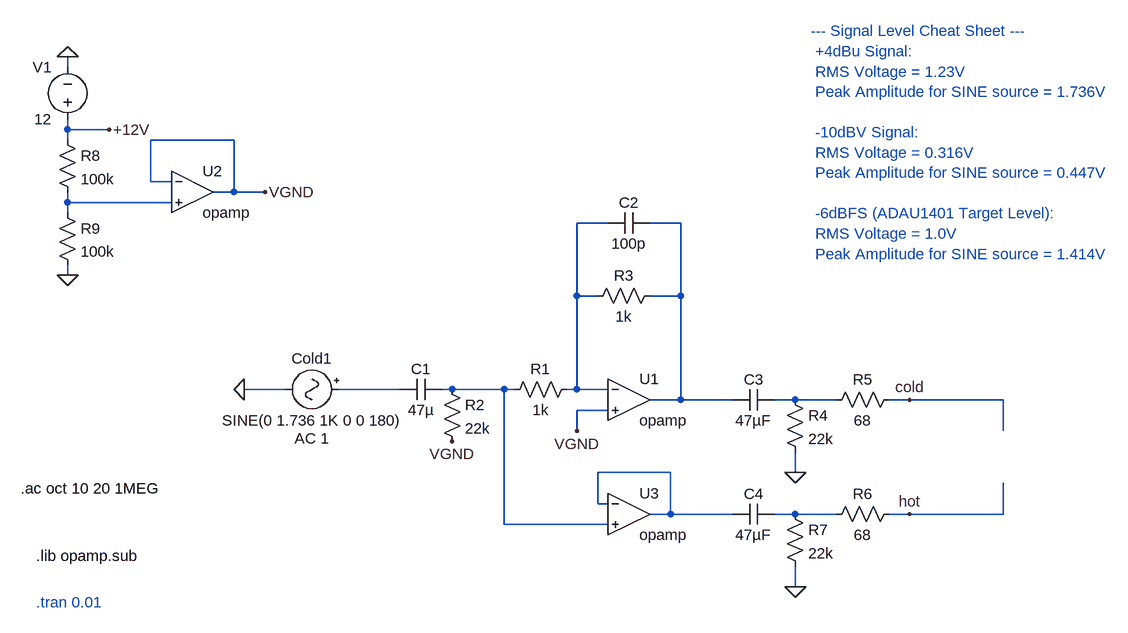
[diagram p0: schematic Output_Interface.asc]
Output_Interface.asc, the LTspice schematic file:
Version 4.1
SHEET 1 996 680
WIRE -640 -384 -640 -400
WIRE -640 -288 -640 -304
WIRE -576 -288 -640 -288
WIRE -640 -272 -640 -288
WIRE -384 -272 -512 -272
WIRE -512 -208 -512 -272
WIRE -480 -208 -512 -208
WIRE -384 -192 -384 -272
WIRE -384 -192 -416 -192
WIRE -336 -192 -384 -192
WIRE -640 -176 -640 -192
WIRE -480 -176 -640 -176
WIRE -640 -160 -640 -176
WIRE 192 -144 144 -144
WIRE 304 -144 256 -144
WIRE -640 -64 -640 -80
WIRE 144 -32 144 -144
WIRE 176 -32 144 -32
WIRE 304 -32 304 -144
WIRE 304 -32 256 -32
WIRE -304 112 -368 112
WIRE -128 112 -224 112
WIRE -48 112 -64 112
WIRE 32 112 -48 112
WIRE 48 112 32 112
WIRE 144 112 144 -32
WIRE 144 112 128 112
WIRE 192 112 144 112
WIRE 304 128 304 -32
WIRE 304 128 256 128
WIRE 384 128 304 128
WIRE 480 128 448 128
WIRE 544 128 480 128
WIRE 656 128 624 128
WIRE 800 128 656 128
WIRE 192 144 144 144
WIRE 144 176 144 144
WIRE 800 176 800 128
WIRE 288 240 176 240
WIRE 480 240 480 208
WIRE 176 288 176 240
WIRE 192 288 176 288
WIRE 288 304 288 240
WIRE 288 304 256 304
WIRE 384 304 288 304
WIRE 480 304 448 304
WIRE 544 304 480 304
WIRE 656 304 624 304
WIRE 800 304 800 256
WIRE 800 304 656 304
WIRE 32 320 32 112
WIRE 192 320 32 320
WIRE 480 416 480 384
FLAG -368 112 0
FLAG -48 192 VGND
FLAG 480 240 0
FLAG 144 176 VGND
FLAG 480 416 0
FLAG -640 -400 0
FLAG -640 -64 0
FLAG -336 -192 VGND
FLAG -576 -288 +12V
FLAG 656 304 hot
FLAG 656 128 cold
SYMBOL OpAmps\\opamp 224 64 R0
SYMATTR InstName U1
SYMBOL Misc\\signal -208 112 R90
WINDOW 0 -32 56 VBottom 2
WINDOW 3 32 56 VTop 2
WINDOW 123 60 56 VTop 2
WINDOW 39 0 0 Left 0
SYMATTR InstName Cold1
SYMATTR Value SINE(0 1.736 1K 0 0 180)
SYMATTR Value2 AC 1
SYMBOL res 144 96 R90
WINDOW 0 0 56 VBottom 2
WINDOW 3 32 56 VTop 2
SYMATTR InstName R1
SYMATTR Value 1k
SYMBOL cap -64 96 R90
WINDOW 0 0 32 VBottom 2
WINDOW 3 32 32 VTop 2
SYMATTR InstName C1
SYMATTR Value 47µ
SYMATTR SpiceLine V=35
SYMBOL res -64 96 R0
SYMATTR InstName R2
SYMATTR Value 22k
SYMBOL res 272 -48 R90
WINDOW 0 0 56 VBottom 2
WINDOW 3 32 56 VTop 2
SYMATTR InstName R3
SYMATTR Value 1k
SYMBOL cap 256 -160 R90
WINDOW 0 0 32 VBottom 2
WINDOW 3 32 32 VTop 2
SYMATTR InstName C2
SYMATTR Value 100p
SYMBOL cap 448 112 R90
WINDOW 0 0 32 VBottom 2
WINDOW 3 32 32 VTop 2
SYMATTR InstName C3
SYMATTR Value 47µF
SYMATTR SpiceLine V=35
SYMBOL res 464 112 R0
SYMATTR InstName R4
SYMATTR Value 22k
SYMBOL res 528 144 R270
WINDOW 0 32 56 VTop 2
WINDOW 3 0 56 VBottom 2
SYMATTR InstName R5
SYMATTR Value 68
SYMBOL res 528 320 R270
WINDOW 0 32 56 VTop 2
WINDOW 3 0 56 VBottom 2
SYMATTR InstName R6
SYMATTR Value 68
SYMBOL res 464 288 R0
SYMATTR InstName R7
SYMATTR Value 22k
SYMBOL cap 448 288 R90
WINDOW 0 0 32 VBottom 2
WINDOW 3 32 32 VTop 2
SYMATTR InstName C4
SYMATTR Value 47µF
SYMATTR SpiceLine V=35
SYMBOL OpAmps\\opamp -448 -256 R0
SYMATTR InstName U2
SYMBOL voltage -640 -288 R180
WINDOW 0 24 96 Left 2
WINDOW 3 24 16 Left 2
WINDOW 123 0 0 Left 0
WINDOW 39 0 0 Left 0
SYMATTR InstName V1
SYMATTR Value 12
SYMBOL res -656 -288 R0
SYMATTR InstName R8
SYMATTR Value 100k
SYMBOL res -656 -176 R0
SYMATTR InstName R9
SYMATTR Value 100k
SYMBOL OpAmps\\opamp 224 240 R0
SYMATTR InstName U3
TEXT -688 440 Left 2 ;.tran 0.01
TEXT -688 368 Left 2 !.lib opamp.sub
TEXT -712 264 Left 2 !.ac oct 10 20 1MEG
TEXT 504 -440 Left 2 ;--- Signal Level Cheat Sheet ---\n +4dBu Signal:\n RMS Voltage = 1.23V\n Peak Amplitude for SINE source = 1.736V\n \n -10dBV Signal:\n RMS Voltage = 0.316V\n Peak Amplitude for SINE source = 0.447V\n \n -6dBFS (ADAU1401 Target Level):\n RMS Voltage = 1.0V\n Peak Amplitude for SINE source = 1.414V

The netlist it stands for:
* Output_Interface.asc
X§U1 N002 VGND N003 opamp Aol=100K GBW=10Meg  ; pins invin noninvin out
V§Cold1 N004 0 SINE(0 1.736 1K 0 0 180) AC 1
R1 N002 N005 1k
C1 N005 N004 47µ V=35
R2 N005 VGND 22k
R3 N003 N002 1k
C2 N003 N002 100p
C3 N006 N003 47µF V=35
R4 N006 0 22k
R5 N006 cold 68
R6 N008 hot 68
R7 N008 0 22k
C4 N008 N007 47µF V=35
X§U2 VGND N001 VGND opamp Aol=100K GBW=10Meg  ; pins invin noninvin out
V1 +12V 0 12
R8 +12V N001 100k
R9 N001 0 100k
X§U3 N007 N005 N007 opamp Aol=100K GBW=10Meg  ; pins invin noninvin out
* .tran 0.01
.lib opamp.sub
.ac oct 10 20 1MEG
* --- Signal Level Cheat Sheet ---
*  +4dBu Signal:
*  RMS Voltage = 1.23V
*  Peak Amplitude for SINE source = 1.736V
*  -10dBV Signal:
*  RMS Voltage = 0.316V
*  Peak Amplitude for SINE source = 0.447V
*  -6dBFS (ADAU1401 Target Level):
*  RMS Voltage = 1.0V
*  Peak Amplitude for SINE source = 1.414V
.backanno
.end